# EAGLE schematic Схема платы копия (EAGLE 9.4.2)
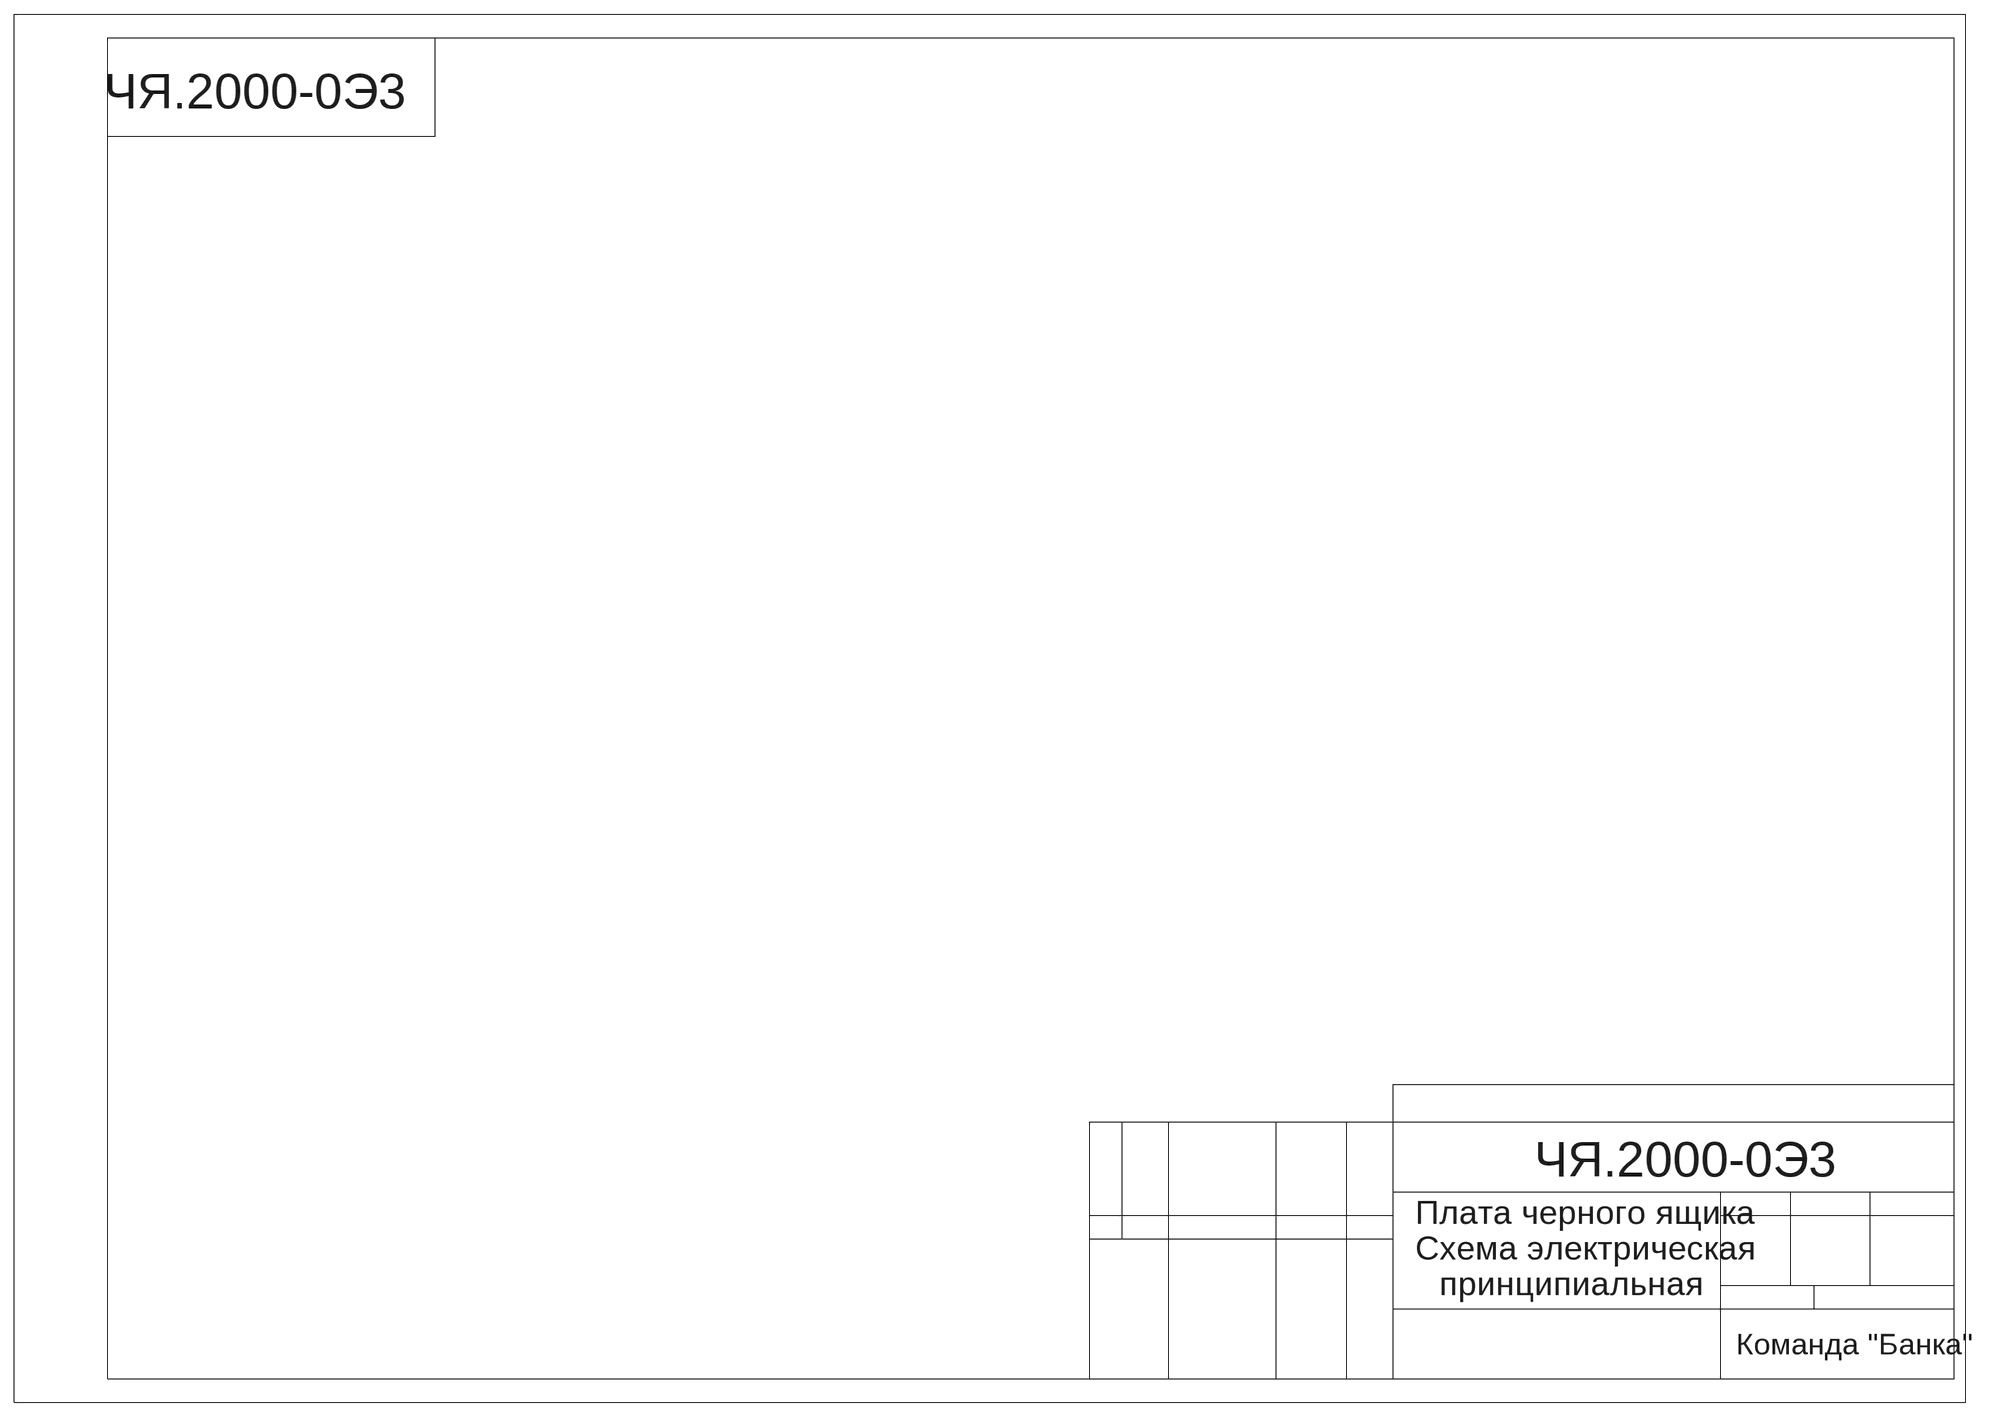
[diagram p0: schematic, sheet 1, part 1 of 2]
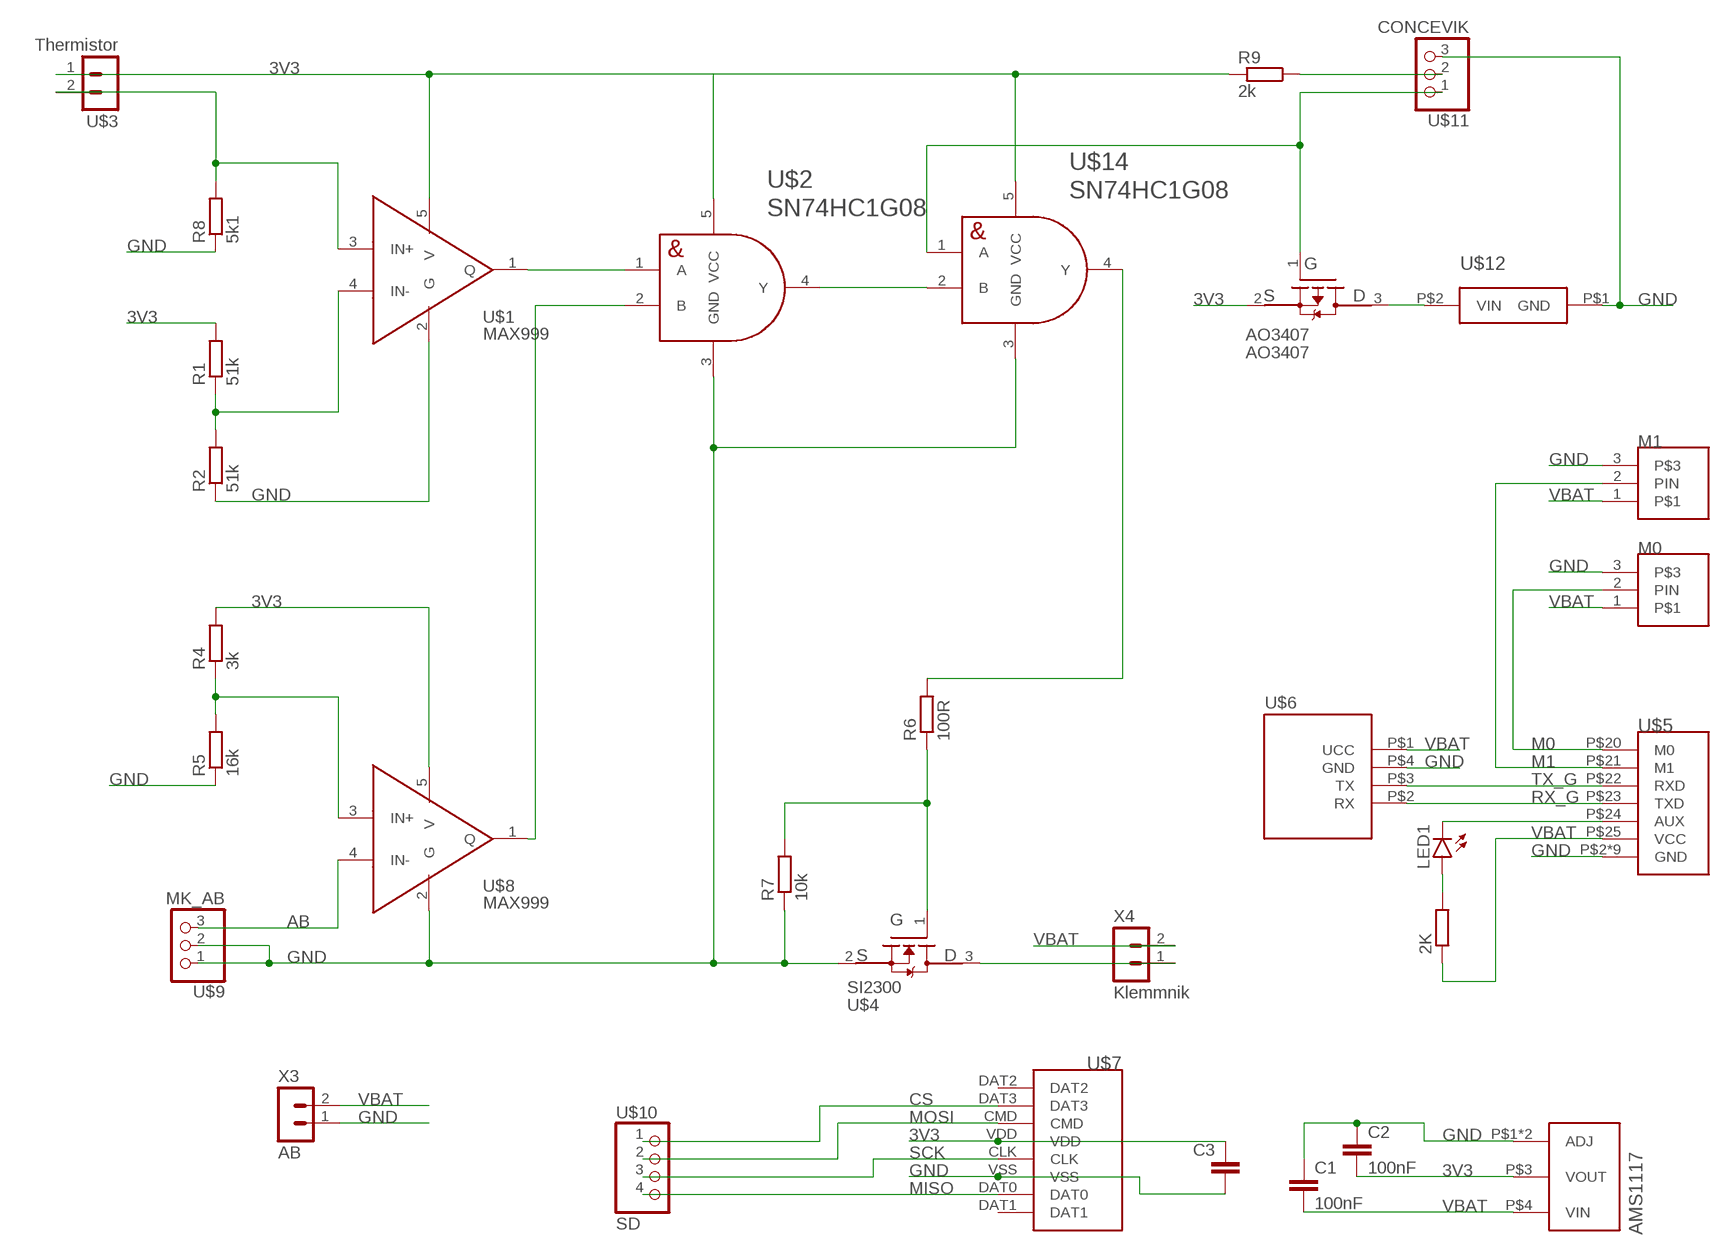
[diagram p1: schematic, sheet 1, part 2 of 2]

## Parts
2K  R-EU_R0603  [R0603]
AMS1117  AMS1117  [SOT223]
AO3407  AO3407  [SOT23-3]
C1  100nF  C-EUC0603  [C0603]
C2  100nF  C-EUC0603  [C0603]
C3  C-EUC0603  [C0603]
LED1  LEDCHIP-LED0603  [CHIP-LED0603]
M0  CONNECT_3  [CONNECT_3]
M1  CONNECT_3  [CONNECT_3]
R1  51k  R-EU_R0603  [R0603]
R2  51k  R-EU_R0603  [R0603]
R4  3k  R-EU_R0603  [R0603]
R5  16k  R-EU_R0603  [R0603]
R6  100R  R-EU_R0603  [R0603]
R7  10k  R-EU_R0603  [R0603]
R8  5k1  R-EU_R0603  [R0603]
R9  2k  R-EU_R0603  [R0603]
U$1  MAX999  [SOT23-5]
U$2  SN74HC1G08  [SOT23-5]
U$3  Thermistor  MOLEX-2-1.25  [53047-02]
U$4  SI2300  [SOT23-3]
U$5  E220-400T22S  [E220-400T22S]
U$6  GPS-NEO7M  [GPS-NEO7M]
U$7  SD  [SD]
U$8  MAX999  [SOT23-5]
U$9  MK_AB  MOLEX-3-1.25  [53047-03]
U$10  SD  MOLEX-4-1.25  [53047-04]
U$11  CONCEVIK  MOLEX-3-1.25  [53047-03]
U$12  BUZZERS8R6  [BUZZER-S8R12]
U$14  SN74HC1G08  [SOT23-5]
X3  AB  JST-2-2.5  [JST-2-2.5]
X4  Klemmnik  JST-2-2.5  [JST-2-2.5]

## Nets
3V3: AMS1117.P$3(VOUT) AO3407.2(PS) C2.2 C3.1 R1.2 R4.2 R9.2 U$1.5(V) U$2.5(VCC) U$3.1 U$7.VDD U$8.5(V) U$14.5(VCC)
AB: U$8.4(IN-) U$9.3
CS: U$7.DAT3 U$10.1
GND: AMS1117.P$1(ADJ) AMS1117.P$2(ADJ) C1.1 C2.1 C3.2 M0.3 M1.3 R2.1 R5.1 R7.1 R8.1 U$1.2(G) U$2.3(GND) U$4.2(NS) U$5.P$2(GND) U$5.P$8(GND) U$5.P$11(GND) U$5.P$13(GND) U$5.P$14(GND) U$5.P$15(GND) U$5.P$16(GND) U$5.P$19(GND) U$5.P$26(GND) U$6.P$4(GND) U$7.VSS U$8.2(G) U$9.1 U$9.2 U$11.3 U$12.P$1(GND) U$14.3(GND) X3.1
M0: M0.2(PIN) U$5.P$20(M0)
M1: M1.2(PIN) U$5.P$21(M1)
MISO: U$7.DAT0 U$10.4
MOSI: U$7.CMD U$10.2
N$1: R8.2 U$1.3(IN+) U$3.2
N$2: R9.1 U$11.2
N$3: R4.1 R5.2 U$8.3(IN+)
N$4: 2K.2 LED1.A
N$5: LED1.C U$5.P$24(AUX)
N$8: R1.1 R2.2 U$1.4(IN-)
N$9: U$1.1(Q) U$2.1(A)
N$10: U$2.2(B) U$8.1(Q)
N$11: U$4.3(ND) X4.1
N$12: U$2.4(Y) U$14.2(B)
N$13: R6.1 R7.2 U$4.1(NG)
N$14: AO3407.3(PD) U$12.P$2(VIN)
N$15: AO3407.1(PG) U$11.1 U$14.1(A)
N$17: R6.2 U$14.4(Y)
RX_G: U$5.P$23(TXD) U$6.P$2(RX)
SCK: U$7.CLK U$10.3
TX_G: U$5.P$22(RXD) U$6.P$3(TX)
VBAT: 2K.1 AMS1117.P$4(VIN) C1.2 M0.1 M1.1 U$5.P$25(VCC) U$6.P$1(UCC) X3.2 X4.2
Unconnected: U$7.DAT1 U$7.DAT2

## Notes on the sheet
- ЧЯ.2000-0Э3
- ЧЯ.2000-0Э3
- Плата черного ящика
- Схема электрическая
- принципиальная
- Команда "Банка"

## Library data of the parts
2K R1 R2 R4-R9 = rcl:R-EU_: RESISTOR, European symbol; SPICEPREFIX: R
AMS1117 = CanCubeSat:AMS1117
AO3407 = Banka-2026:AO3407
C1-C3 = rcl:C-EU: CAPACITOR, European symbol; SPICEPREFIX: C
LED1 = led:LED: LED OSRAM: - CHIPLED LG R971, LG N971, LY N971, LG Q971, LY Q971, LO R971, LY R971 LH N974, LH R974 LS Q976, LO Q976, LY Q976 LO Q996 - Hyper CHIPLED LW Q18S LB Q993, LB Q99A, LB R99A - SideLED LS A670, LO A670, LY A670, LG A670, LP A670 LB A673, LV A673, LT A673, LW A673 LH A674 LY A675 LS A676, LA A676, LO A676, LY A676, LW A676 LS A679, LY A679, LG A679 - Hyper Micro SIDELED® LS Y876, LA Y876, LO Y876, LY Y876 LT Y87S - SmartLED LW L88C, LW L88S LB L89C, LB L89S, LG L890 LS L89K, LO L89K, LY L89K LS L896, LA L896, LO L896, LY L896 - TOPLED LS T670, LO T670, LY T670, LG T670, LP T670 LSG T670, LSP T670, LSY T670, LOP T670, LYG T670 LG T671, LOG T671, LSG T671 LB T673, LV T673, LT T673, LW T673 LH T674 LS T676, LA T676, LO T676, LY T676, LB T676, LH T676, LSB T676, LW T676 LB T67C, LV T67C, LT T67C, LS T67K, LO T67K, LY T67K, LW E67C LS E67B, LA E67B, LO E67B, LY E67B, LB E67C, LV E67C, LT E67C LW T67C LS T679, LY T679, LG T679 LS T770, LO T770, LY T770, LG T770, LP T770 LB T773, LV T773, LT T773, LW T773 LH T774 LS E675, LA E675, LY E675, LS T675 LS T776, LA T776, LO T776, LY T776, LB T776 LHGB T686 LT T68C, LB T68C - Hyper Mini TOPLED® LB M676 - Mini TOPLED Santana® LG M470 LS M47K, LO M47K, LY M47K Source: http://www.osram.convergy.de LUXEON: - LUMILED® LXK2-PW12-R00, LXK2-PW12-S00, LXK2-PW14-U00, LXK2-PW14-V00 LXK2-PM12-R00, LXK2-PM12-S00, LXK2-PM14-U00 LXK2-PE12-Q00, LXK2-PE12-R00, LXK2-PE12-S00, LXK2-PE14-T00, LXK2-PE14-U00 LXK2-PB12-K00, LXK2-PB12-L00, LXK2-PB12-M00, LXK2-PB14-N00, LXK2-PB14-P00, LXK2-PB14-Q00 LXK2-PR12-L00, LXK2-PR12-M00, LXK2-PR14-Q00, LXK2-PR14-R00 LXK2-PD12-Q00, LXK2-PD12-R00, LXK2-PD12-S00 LXK2-PH12-R00, LXK2-PH12-S00 LXK2-PL12-P00, LXK2-PL12-Q00, LXK2-PL12-R00 Source: www.luxeon.com KINGBRIGHT: KA-3528ASYC Source: www.kingbright.com
M0 M1 = UNKNOWN-2024:CONNECT_3
U$1 U$8 = Banka-2026:MAX999
U$2 U$14 = Banka-2026:SN74HC1G08
U$3 = UNKNOWN-2024:MOLEX-2-1.25
U$4 = Banka-2026:SI2300
U$5 = UNKNOWN-2024:E220-400T22S
U$6 = UNKNOWN-2024:GPS-NEO7M
U$7 = UNKNOWN-2024:SD
U$9 U$11 = UNKNOWN-2024:MOLEX-3-1.25
U$10 = UNKNOWN-2024:MOLEX-4-1.25
U$12 = Banka-2026:BUZZER
X3 X4 = UNKNOWN-2024:JST-2-2.5: JST PH series header 2.00mm pitch disconnectable crimp style connectors, vertical (side entry type), 2 pins